# Altium project pca63100.PrjPCB (part 1 of 3)
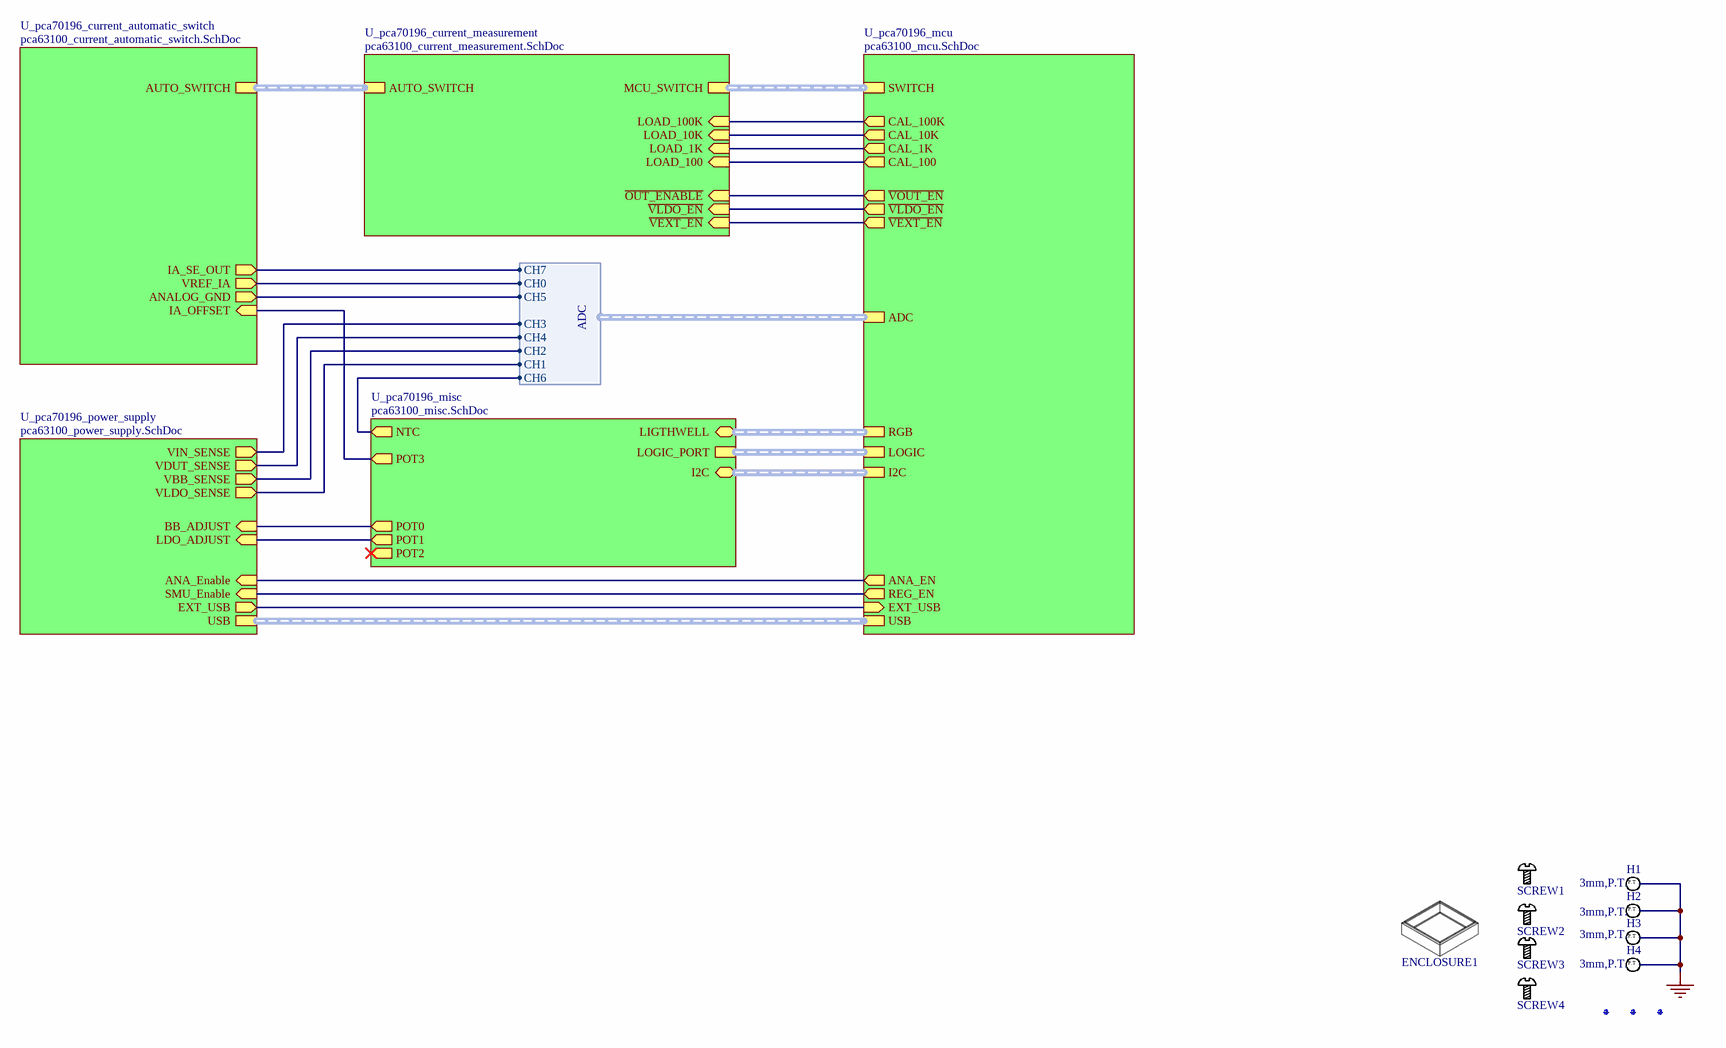
[diagram p0: pca63100_top.SchDoc]
Author: HANY; BoardThickness: 1.6mm; BoardTitle: Power Profiler Kit II; NrOfLayers: 4; Organization: Nordic Semiconductor; PCAName: pca63100; PCBNumber: 400491; PCBRevision: 0016HANY; PCBStackup: 4001; ProjectName: Power Profiler Kit II; ProjectNumber: PCA63100; Revision: 1.0.1; SilkscreenColor: White; SoldermaskColor: Blue; SurfaceFinish: ENIG
6 sheets, 280 parts. Net scope: hierarchical (ports join the sheet entries above them; power ports are global).
Board file: 400491.PcbDoc
Sheets:
  pca63100_top.SchDoc
    U_pca70196_current_automatic_switch = pca63100_current_automatic_switch.SchDoc
    U_pca70196_current_measurement = pca63100_current_measurement.SchDoc
    U_pca70196_power_supply = pca63100_power_supply.SchDoc
    U_pca70196_misc = pca63100_misc.SchDoc
    U_pca70196_mcu = pca63100_mcu.SchDoc

## Sheet pca63100_top.SchDoc: Power Profiler Kit II
size A3; Organization: Nordic Semiconductor; Revision: 1.0.1; SheetNumber: 1; SheetTotal: 6; Author: HANY; CompanyName: Nordic Semiconductor; DrawnBy: HANY; DocumentSize: A3; ProjectName: Power Profiler Kit II

### Parts
ENCLOSURE1  Plastic Enclosure  [Enclosure_PPK2]  (value not drawn)
Fid1  Fiducial mark  [Fiducial_Round-Square]  (value not drawn)  (no BOM)
Fid2  Fiducial mark  [Fiducial_Round-Square]  (value not drawn)  (no BOM)
Fid3  Fiducial mark  [Fiducial_Round-Square]  (value not drawn)  (no BOM)
H1  3mm,P.T.  [HOLE_PT_3MM]  (no BOM)
H2  3mm,P.T.  [HOLE_PT_3MM]  (no BOM)
H3  3mm,P.T.  [HOLE_PT_3MM]  (no BOM)
H4  3mm,P.T.  [HOLE_PT_3MM]  (no BOM)
SCREW1  Screw  [Screw_25x50_pan_tx]  (value not drawn)
SCREW2  Screw  [Screw_25x50_pan_tx]  (value not drawn)
SCREW3  Screw  [Screw_25x50_pan_tx]  (value not drawn)
SCREW4  Screw  [Screw_25x50_pan_tx]  (value not drawn)

### Sub-sheets
U_pca70196_current_automatic_switch = pca63100_current_automatic_switch.SchDoc: IA_SE_OUT (out), IA_OFFSET (in), AUTO_SWITCH (harness SW), VREF_IA (out), ANALOG_GND (out)
U_pca70196_current_measurement = pca63100_current_measurement.SchDoc: ~{OUT_ENABLE} (in), LOAD_100 (in), LOAD_1K (in), LOAD_100K (in), LOAD_10K (in), ~{VEXT_EN} (in), MCU_SWITCH (harness SW), AUTO_SWITCH (harness SW), ~{VLDO_EN} (in)
U_pca70196_mcu = pca63100_mcu.SchDoc: RGB (harness LED), SWITCH (harness SW), I2C (harness I2C), ADC (harness ADC), CAL_10K (out), USB (harness USB), CAL_100K (out), CAL_1K (out), ~{VEXT_EN} (out), CAL_100 (out), ~{VLDO_EN} (out), ~{VOUT_EN} (out), EXT_USB (in), REG_EN (out), ANA_EN (out), LOGIC (harness LP)
U_pca70196_misc = pca63100_misc.SchDoc: POT0 (out), POT1 (out), POT2 (out), POT3 (out), LIGTHWELL (bidir, harness LED), I2C (bidir, harness I2C), NTC (out), LOGIC_PORT (harness LP)
U_pca70196_power_supply = pca63100_power_supply.SchDoc: USB (harness USB), BB_ADJUST (in), LDO_ADJUST (in), VDUT_SENSE (out), VIN_SENSE (out), VLDO_SENSE (out), VBB_SENSE (out), EXT_USB (out), ANA_Enable (in), SMU_Enable (in)

### Harnesses
ADC: CH0, CH1, CH2, CH3, CH4, CH5, CH6, CH7

### Nets
GND: H1.1 H2.1 H3.1 H4.1
P0.02/AIN0_VREF_IA: sheet U_pca70196_current_automatic_switch/VREF_IA, sheet U_pca70196_mcu/ADC.CH0
P0.03/AIN1_VLDO: sheet U_pca70196_power_supply/VLDO_SENSE, sheet U_pca70196_mcu/ADC.CH1
P0.04/AIN2_VBB: sheet U_pca70196_power_supply/VBB_SENSE, sheet U_pca70196_mcu/ADC.CH2
P0.05/AIN3_VIN: sheet U_pca70196_power_supply/VIN_SENSE, sheet U_pca70196_mcu/ADC.CH3
P0.06_VEXT_EN: sheet U_pca70196_current_measurement/~{VEXT_EN}, sheet U_pca70196_mcu/~{VEXT_EN}
P0.07_VLDO_EN: sheet U_pca70196_current_measurement/~{VLDO_EN}, sheet U_pca70196_mcu/~{VLDO_EN}
P0.08_ANA_EN: sheet U_pca70196_power_supply/ANA_Enable, sheet U_pca70196_mcu/ANA_EN
P0.20_CAL100K: sheet U_pca70196_current_measurement/LOAD_100K, sheet U_pca70196_mcu/CAL_100K
P0.21_CAL10K: sheet U_pca70196_current_measurement/LOAD_10K, sheet U_pca70196_mcu/CAL_10K
P0.22_CAL1K: sheet U_pca70196_current_measurement/LOAD_1K, sheet U_pca70196_mcu/CAL_1K
P0.23_CAL100: sheet U_pca70196_current_measurement/LOAD_100, sheet U_pca70196_mcu/CAL_100
P0.28/AIN4_VDUT: sheet U_pca70196_power_supply/VDUT_SENSE, sheet U_pca70196_mcu/ADC.CH4
P0.29/AIN5_AGND: sheet U_pca70196_current_automatic_switch/ANALOG_GND, sheet U_pca70196_mcu/ADC.CH5
P0.30/AIN6_NTC: sheet U_pca70196_misc/NTC, sheet U_pca70196_mcu/ADC.CH6
P0.31/AIN7_VSE_IA: sheet U_pca70196_current_automatic_switch/IA_SE_OUT, sheet U_pca70196_mcu/ADC.CH7
P1.04_VOUT_EN: sheet U_pca70196_current_measurement/~{OUT_ENABLE}, sheet U_pca70196_mcu/~{VOUT_EN}
P1.09_EXT_USB: sheet U_pca70196_power_supply/EXT_USB, sheet U_pca70196_mcu/EXT_USB
P1.13: sheet U_pca70196_power_supply/SMU_Enable, sheet U_pca70196_mcu/REG_EN
POT0: sheet U_pca70196_power_supply/BB_ADJUST, sheet U_pca70196_misc/POT0
POT1: sheet U_pca70196_power_supply/LDO_ADJUST, sheet U_pca70196_misc/POT1
POT3: sheet U_pca70196_current_automatic_switch/IA_OFFSET, sheet U_pca70196_misc/POT3

### Buses and harness runs
harness sheet U_pca70196_current_automatic_switch/AUTO_SWITCH = sheet U_pca70196_current_measurement/AUTO_SWITCH
harness sheet U_pca70196_current_measurement/MCU_SWITCH = sheet U_pca70196_mcu/SWITCH
harness sheet U_pca70196_mcu/I2C = sheet U_pca70196_misc/I2C
harness sheet U_pca70196_mcu/LOGIC = sheet U_pca70196_misc/LOGIC_PORT
harness sheet U_pca70196_mcu/RGB = sheet U_pca70196_misc/LIGTHWELL
harness sheet U_pca70196_mcu/USB = sheet U_pca70196_power_supply/USB

### Notes on the sheet
- Size
- Date:
- A3
- Project Number
- Sheet         of
- Revision
- File:
- Drawn By:
- (in symbol Hole_3MM_PT) P.T

### Library data of the parts
ENCLOSURE1 = Enclosure_PPK2: PPK2 Moulded plastic casing; Manufacturer: Proto Labs, Inc.; Manufacturer Part Number: PPK plexi rev 1.2; Part number IPS: 4971; Pad Count: 0; Part Number: Enclosure_PPK2; ComponentLink1Description: Datasheet; ComponentLink2Description: Supplier link; HelpURL: https://www.protolabs.com; Footprint Doc: Plastic casing; LatestRevisionDate: 2020-10-01; Publisher: Nordic Semiconductor; Published: 2020-10-01; Value: Plastic Enclosure; Component Class: Mechanical; PartId: 101200001
Fid1-Fid3 = Fid-Mark-Round-Square: Artikkelnr Noca: N.A.; Pad Count: 1; Part Number: Fid-Mark-Round-Square; LatestRevisionDate: 2017-01-30; Pin Count: 1; Publisher: Nordic Semiconductor; Published: 2009-12-12; Footprint Doc: Fiducial; Part number IPS: N.A.; ComponentLink1Description: Datasheet; ComponentLink2Description: Supplier link; Component Class: Connectors; PartId: 100500075
H1-H4 = Hole_3MM_PT: Regular Plate Through, 3mm hole; Manufacturer: Nordic Semiconductor; Artikkelnr Noca: N.A.; Pad Count: 1; Part Number: Hole_3MM_PT; Footprint Doc: Hole_3MM_PT; LatestRevisionDate: 2013-05-29; Pin Count: 1; Publisher: Nordic Semiconductor; Published: 2013-05-29; Value: 3mm,P.T.; Note: Regular Plate Through, 3mm hole; Part number IPS: N.A.; ComponentLink1Description: Datasheet; ComponentLink2Description: Supplier link; Component Class: Connectors; PartId: 100500146
SCREW1-SCREW4 = Screw_25x50_pan_tx: Pan head, torx, 2.5x5mm screw; Manufacturer: Bossard; Manufacturer Part Number: 3205129; Part number IPS: 4972; Pad Count: 0; Part Number: Screw_25x50_pan_tx; ComponentLink1Description: Datasheet; ComponentLink2Description: Supplier link; HelpURL: https://www.tme.eu/pl/en/details/b2.5x5_bn13265/screws/bossard/3205129/; Footprint Doc: T8 screw; LatestRevisionDate: 2020-10-01; Publisher: Nordic Semiconductor; Published: 2020-10-01; Value: Screw; Component Class: Mechanical; PartId: 101200002

## Sheet pca63100_current_automatic_switch.SchDoc: Power Profiler Kit II
size A3; Organization: Nordic Semiconductor; Revision: 1.0.1; SheetNumber: 5; SheetTotal: 6; Author: HANY; CompanyName: Nordic Semiconductor; DrawnBy: HANY; DocumentSize: A3; ProjectName: Power Profiler Kit II
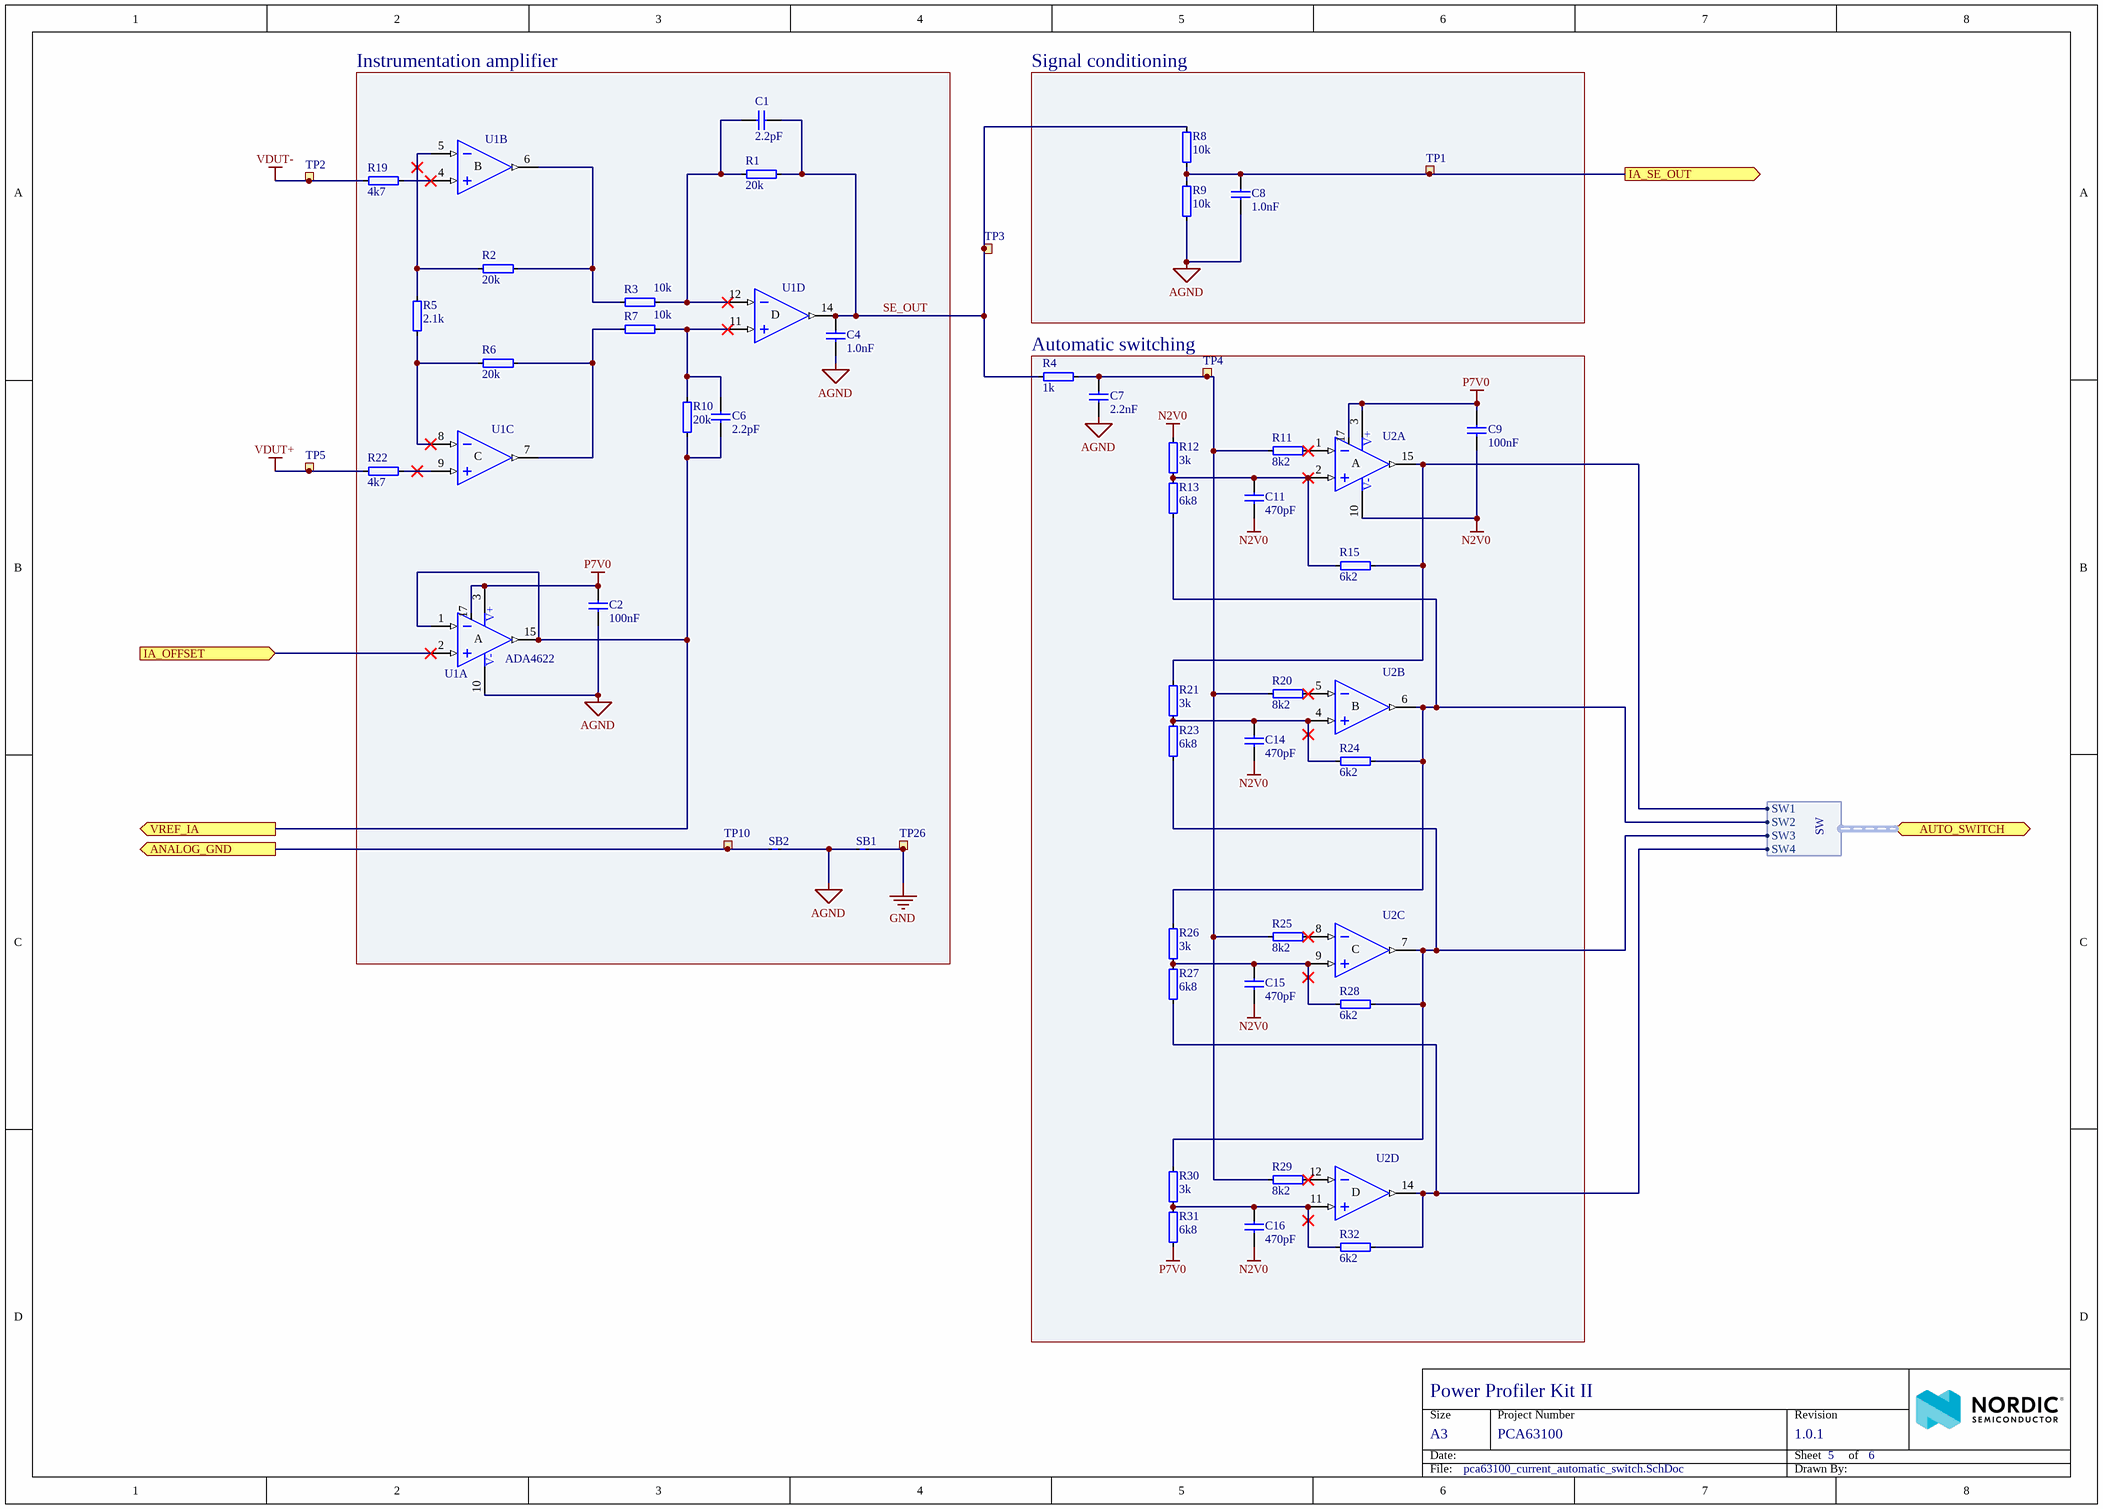
[diagram p1: pca63100_current_automatic_switch.SchDoc]

### Parts
C1  2.2pF  [CAPC0603X03L_C]
C2  100nF  [CAPC0603X03L_C]
C4  1.0nF  [CAPC0603X03L_C]
C6  2.2pF  [CAPC0603X03L_C]
C7  2.2nF  [CAPC0603X03L_C]
C8  1.0nF  [CAPC0603X03L_C]
C9  100nF  [CAPC0603X03L_C]
C11  470pF  [CAPC0603X03L_C]
C14  470pF  [CAPC0603X03L_C]
C15  470pF  [CAPC0603X03L_C]
C16  470pF  [CAPC0603X03L_C]
R1  20k  [RESC0603X03L_C]
R2  20k  [RESC0603X03L_C]
R3  10k  [RESC0603X03L_C]
R4  1k  [RESC0603X03L_C]
R5  2.1k  [RESC0603X03L_C]
R6  20k  [RESC0603X03L_C]
R7  10k  [RESC0603X03L_C]
R8  10k  [RESC0603X03L_C]
R9  10k  [RESC0603X03L_C]
R10  20k  [RESC0603X03L_C]
R11  8k2  [RESC0603X03L_C]
R12  3k  [RESC0603X03L_C]
R13  6k8  [RESC0603X03L_C]
R15  6k2  [RESC0603X03L_C]
R19  4k7  [RESC0603X03L_C]
R20  8k2  [RESC0603X03L_C]
R21  3k  [RESC0603X03L_C]
R22  4k7  [RESC0603X03L_C]
R23  6k8  [RESC0603X03L_C]
R24  6k2  [RESC0603X03L_C]
R25  8k2  [RESC0603X03L_C]
R26  3k  [RESC0603X03L_C]
R27  6k8  [RESC0603X03L_C]
R28  6k2  [RESC0603X03L_C]
R29  8k2  [RESC0603X03L_C]
R30  3k  [RESC0603X03L_C]
R31  6k8  [RESC0603X03L_C]
R32  6k2  [RESC0603X03L_C]
SB1  NetTie_200um  [NetTie_200um]  (value not drawn)  (net tie, no BOM)
SB2  NetTie_200um  [NetTie_200um]  (value not drawn)  (net tie, no BOM)
TP1  Ø0.7mm,SMD  [TP_SMD_Ø0.7mm]  (value not drawn)  (no BOM)
TP2  Ø0.7mm,SMD  [TP_SMD_Ø0.7mm]  (value not drawn)  (no BOM)
TP3  Ø0.7mm,SMD  [TP_SMD_Ø0.7mm]  (value not drawn)  (no BOM)
TP4  Ø0.7mm,SMD  [TP_SMD_Ø0.7mm]  (value not drawn)  (no BOM)
TP5  Ø0.7mm,SMD  [TP_SMD_Ø0.7mm]  (value not drawn)  (no BOM)
TP10  Ø0.7mm,SMD  [TP_SMD_Ø0.7mm]  (value not drawn)  (no BOM)
TP26  Ø0.7mm,SMD  [TP_SMD_Ø0.7mm]  (value not drawn)  (no BOM)
U1  ADA4622  [QFN65P400X400X80_HS-17N]  (parts A,B,C,D of 4)
U2  ADA4622  [QFN65P400X400X80_HS-17N]  (value not drawn)  (parts A,B,C,D of 4)

### Blocks framed on the sheet
Instrumentation amplifier: C1 C2 C4 C6 R1-R3 R5-R7 R10 R19 R22 SB1 SB2 TP10 TP26 U1
Signal conditioning: C8 R8 R9 TP1
Automatic switching: C7 C9 C11 C14-C16 R4 R11-R13 R15 R20 R21 R23-R32 TP4 U2

### Ports
ANALOG_GND (out), AUTO_SWITCH (bidir, harness SW), IA_OFFSET (in), IA_SE_OUT (out), VREF_IA (out)

### Harnesses
SW: SW1, SW2, SW3, SW4

### Nets
AGND: C2.2 C4.1 C7.1 C8.1 R9.1 SB1.1 SB2.2 U1.10(VSS)
GND: SB1.2 TP26.1
N2V0: C9.1 C11.1 C14.1 C15.1 C16.1 R12.2 U2.10(VSS)
P7V0: C2.1 C9.2 R31.1 U1.3(VDD) U1.17(EPAD) U2.3(VDD) U2.17(EPAD)
VDUT+: R22.2 TP5.1
VDUT-: R19.2 TP2.1
AUTO_SW1: R15.2 R21.2 U2.15(OUTA) ; port AUTO_SWITCH.SW1
AUTO_SW2: R13.1 R24.2 R26.2 U2.6(OUTB) ; port AUTO_SWITCH.SW2
AUTO_SW3: R23.1 R28.2 R30.2 U2.7(OUTC) ; port AUTO_SWITCH.SW3
AUTO_SW4: R27.1 R32.2 U2.14(OUTD) ; port AUTO_SWITCH.SW4
P0.02/AIN0_VREF_IA: C6.1 R10.1 U1.1(IN_A-) U1.15(OUTA) ; port VREF_IA
P0.29/AIN5_AGND: SB2.1 TP10.1 ; port ANALOG_GND
P0.31/AIN7_VSE_IA: C8.2 R8.2 R9.2 TP1.1 ; port IA_SE_OUT
POT3: U1.2(IN_A+) ; port IA_OFFSET
SE_OUT: C1.2 C4.2 R1.2 R4.1 R8.1 TP3.1 U1.14(OUTD)
NetC1_1: C1.1 R1.1 R3.2 U1.12(IN_D-)
NetC6_2: C6.2 R7.2 R10.2 U1.11(IN_D+)
NetC7_2: C7.2 R4.2 R11.1 R20.1 R25.1 R29.1 TP4.1
NetC11_2: C11.2 R12.1 R13.2 R15.1 U2.2(IN_A+)
NetC14_2: C14.2 R21.1 R23.2 R24.1 U2.4(IN_B+)
NetC15_2: C15.2 R26.1 R27.2 R28.1 U2.9(IN_C+)
NetC16_2: C16.2 R30.1 R31.2 R32.1 U2.11(IN_D+)
NetR2_1: R2.1 R5.2 U1.5(IN_B-)
NetR2_2: R2.2 R3.1 U1.6(OUTB)
NetR5_1: R5.1 R6.1 U1.8(IN_C-)
NetR6_2: R6.2 R7.1 U1.7(OUTC)
NetR11_2: R11.2 U2.1(IN_A-)
NetR19_1: R19.1 U1.4(IN_B+)
NetR20_2: R20.2 U2.5(IN_B-)
NetR22_1: R22.1 U1.9(IN_C+)
NetR25_2: R25.2 U2.8(IN_C-)
NetR29_2: R29.2 U2.12(IN_D-)

Not connected (* = marked no-connect by the designer): U1 13(NIC) 16(NIC); U2 13(NIC) 16(NIC)

### Notes on the sheet
- Size
- Date:
- A3
- Project Number
- Sheet         of
- Revision
- File:
- Drawn By:
- (in symbol ADA4622-4, part A) V+; A; V-
- (in symbol ADA4622-4, part B) B
- (in symbol ADA4622-4, part C) C
- (in symbol ADA4622-4, part D) D

### Library data of the parts
C1 C6 = C0201-2.2p: Chip Cap 0201; Note: Chip Cap 1%; Artikkelnr Noca: N.A.; Pad Count: 2; Part Number: C0201-2.2p; ComponentLink1Description: Datasheet; ComponentLink2Description: Supplier link; Footprint Doc: 0201; LatestRevisionDate: 2014-11-13; Pin Count: 2; Publisher: Nordic Semiconductor; Published: 2014-11-13; Value: 2.2pF; Part number IPS: N.A.; Component Class: Capacitors; PartId: 100200020
C2 C9 = C0201-100n: Capacitor, X5R, ±10%; Part number IPS: 00000001248, 00000002505; Note: 16V; Artikkelnr Noca: N.A.; Pad Count: 2; Part Number: C0201-100n; Footprint Doc: 0201; LatestRevisionDate: 2017-11-09; Pin Count: 2; Publisher: Nordic Semiconductor; Published: 2014-11-13; Value: 100nF; ComponentLink1Description: Datasheet; ComponentLink2Description: Supplier link; Component Class: Capacitors; PartId: 100200078
C4 C8 = C0201-1n0: Capacitor, X7R, ±10%; Part number IPS: 00000003206; Note: 16V; Artikkelnr Noca: N.A.; Pad Count: 2; Part Number: C0201-1n0; ComponentLink1Description: Datasheet; ComponentLink2Description: Supplier link; Footprint Doc: 0201; LatestRevisionDate: 2020-10-13; Pin Count: 2; Publisher: Nordic Semiconductor; Published: 2014-11-13; Value: 1.0nF; Component Class: Capacitors; PartId: 100200056
C7 = C0201-2n2: Capacitor, X7R, ±10%, 10V; Part number IPS: 00000001778; Artikkelnr Noca: N.A.; Pad Count: 2; Part Number: C0201-2n2; ComponentLink1Description: Datasheet; ComponentLink2Description: Supplier link; Footprint Doc: 0201; LatestRevisionDate: 2014-11-13; Pin Count: 2; Publisher: Nordic Semiconductor; Published: 2014-11-13; Value: 2.2nF; Note: 10V; Component Class: Capacitors; PartId: 100200060
C11 C14-C16 = C0201-470p: Chip Cap 0201; Part number IPS: 00000005775; Note: Chip Cap 1%; Artikkelnr Noca: N.A.; Pad Count: 2; Part Number: C0201-470p; ComponentLink1Description: Datasheet; ComponentLink2Description: Supplier link; Footprint Doc: 0201; LatestRevisionDate: 2020-10-13; Publisher: Nordic Semiconductor; Published: 2014-11-13; Value: 470pF; Component Class: Capacitors; PartId: 100200052
  C11 C14: Pin Count: 2
R1 R2 R6 R10 = R0201-20k_0.1%: Resistor, ±0.1%, 0.031W; Part number IPS: 00000004785; Note: Chip Res 0.1%; Artikkelnr Noca: N.A.; Pad Count: 2; Part Number: R0201-20k_0.1%; ComponentLink1Description: Datasheet; ComponentLink2Description: Supplier link; Footprint Doc: 0201; LatestRevisionDate: 2019-10-07; Pin Count: 2; Publisher: Nordic Semiconductor; Published: 2019-10-07; Value: 20k; Component Class: Resistors; PartId: 100100598
R3 R7-R9 = R0201-10k_0.1%: Resistor, ±0.1%, 0.031W; Part number IPS: 00000004786; Note: Chip Res 0.1%; Artikkelnr Noca: N.A.; Pad Count: 2; Part Number: R0201-10k_0.1%; ComponentLink1Description: Datasheet; ComponentLink2Description: Supplier link; Footprint Doc: 0201; LatestRevisionDate: 2019-10-07; Pin Count: 2; Publisher: Nordic Semiconductor; Published: 2019-10-07; Value: 10k; Component Class: Resistors; PartId: 100100597
R4 = R0201-1k0: Resistor, ±1%, 0.05W; Part number IPS: 00000005786; Note: Chip Res 1%; Artikkelnr Noca: N.A.; Pad Count: 2; Part Number: R0201-1k0; ComponentLink1Description: Datasheet; ComponentLink2Description: Supplier link; Footprint Doc: 0201; LatestRevisionDate: 2014-11-13; Publisher: Nordic Semiconductor; Published: 2014-11-13; Value: 1k; Component Class: Resistors; PartId: 100100043
R5 = R0201-2k1: RES SMD 2.1K OHM 1% 1/20W 0201; Manufacturer: Panasonic; Manufacturer Part Number: ERJ-1GEF2101C; Part number IPS: 00000004787; Note: Chip Res 1%; Artikkelnr Noca: N.A.; Pad Count: 2; Part Number: R0201-2k1; ComponentLink1Description: Datasheet; ComponentLink2Description: Supplier link; HelpURL: http://media.digikey.com/pdf/Data%20Sheets/Panasonic%20Resistors%20Thermistors%20PDFs/ERJ_G,R,E_Rev08.pdf; Footprint Doc: 0201; LatestRevisionDate: 2017-02-13; Pin Count: 2; Publisher: Nordic Semiconductor; Published: 2017-02-13; Value: 2.1k; Supplier 1: Digi-Key; Supplier Part Number 1: P2.10KABCT-ND; Component Class: Resistors; PartId: 100100573
R11 R15 R20 R24 R25 R28 R29 = R0201-8k2: Resistor, ±1%, 0.05W; Part number IPS: 00000004788; Note: Chip Res 1%; Artikkelnr Noca: N.A.; Pad Count: 2; Part Number: R0201-8k2; ComponentLink1Description: Datasheet; ComponentLink2Description: Supplier link; Footprint Doc: 0201; LatestRevisionDate: 2014-11-13; Pin Count: 2; Publisher: Nordic Semiconductor; Published: 2014-11-13; Component Class: Resistors; PartId: 100100064
  R11 R20 R25 R29: Value: 8k2
  R15 R24 R28: Value: 6k2
R12 R21 R26 R30 = R0201-3k0: Resistor, ±1%, 0.05W; Part number IPS: 00000001688; Note: Chip Res 1%; Artikkelnr Noca: N.A.; Pad Count: 2; Part Number: R0201-3k0; ComponentLink1Description: Datasheet; ComponentLink2Description: Supplier link; Footprint Doc: 0201; LatestRevisionDate: 2014-11-13; Pin Count: 2; Publisher: Nordic Semiconductor; Published: 2014-11-13; Value: 3k; Component Class: Resistors; PartId: 100100056
R13 R23 R27 R31 R32 = R0201-6k8: Resistor, ±1%, 0.05W; Part number IPS: 00000001705; Note: Chip Res 1%; Artikkelnr Noca: N.A.; Pad Count: 2; Part Number: R0201-6k8; ComponentLink1Description: Datasheet; ComponentLink2Description: Supplier link; Footprint Doc: 0201; LatestRevisionDate: 2014-11-13; Pin Count: 2; Publisher: Nordic Semiconductor; Published: 2014-11-13; Component Class: Resistors; PartId: 100100063
  R13 R23 R27 R31: Value: 6k8
  R32: Value: 6k2
R19 R22 = R0201-4k7: Resistor, ±1%, 0.05W; Part number IPS: 00000001706; Note: Chip Res 1%; Artikkelnr Noca: N.A.; Pad Count: 2; Part Number: R0201-4k7; ComponentLink1Description: Datasheet; ComponentLink2Description: Supplier link; Footprint Doc: 0201; LatestRevisionDate: 2014-11-13; Pin Count: 2; Publisher: Nordic Semiconductor; Published: 2014-11-13; Value: 4k7; Component Class: Resistors; PartId: 100100061
SB1 SB2 = NetTie 0.2mm: Net Tie; Artikkelnr Noca: N.A.; Pad Count: 2; Part Number: NetTie 0.2mm; ComponentLink1Description: Datasheet; ComponentLink2Description: Supplier link; Footprint Doc: NetTie; LatestRevisionDate: 2019-10-07; Pin Count: 2; Publisher: Nordic Semiconductor; Published: 2019-10-07; Value: NetTie_200um; Part number IPS: N.A.; Component Class: Connectors; PartId: 100500654
TP1-TP5 TP10 TP26 = TP_SMD_Ø0.7MM: 0.7mm circular SMD testpad; Manufacturer: Nordic Semiconductor; Artikkelnr Noca: N.A.; Pad Count: 1; Part Number: TP_SMD_Ø0.7MM; ComponentLink1Description: Datasheet; ComponentLink2Description: Supplier link; Footprint Doc: TP_SMD_Ø0.7mm; LatestRevisionDate: 2017-12-14; Pin Count: 1; Publisher: Nordic Semiconductor; Published: 2017-12-14; Value: Ø0.7mm,SMD; Part number IPS: N.A.; Component Class: Connectors; PartId: 100500474
U1 U2 = ADA4622-4: J-FET Amplifier 4 Circuit Rail-to-Rail 16-LFCSP (4x4); Manufacturer: Analog Devices; Manufacturer Part Number: ADA4622-4ACPZ-RL; Part number IPS: 00000004963; Artikkelnr Noca: N.A.; Pad Count: 17; Part Number: ADA4622-4; ComponentLink1URL: https://www.analog.com/media/en/technical-documentation/data-sheets/ada4622-1-4622-2-4622-4.pdf; ComponentLink1Description: Datasheet; ComponentLink2URL: https://www.digikey.no/product-detail/en/analog-devices-inc/ADA4622-4ACPZ-RL/ADA4622-4ACPZ-RL-ND/6490586; ComponentLink2Description: Supplier link; HelpURL: https://www.analog.com/en/products/ada4622-4.html; Footprint Doc: QFN-16; LatestRevisionDate: 2019-06-19; Pin Count: 17; Publisher: Nordic Semiconductor; Published: 2019-06-19; Value: ADA4622; Supplier 1: Digi-Key; Supplier Part Number 1: ADA4622-4ACPZ-R7-ND; Supplier 2: Mouser; Supplier Part Number 2: 584-ADA4622-4ACPZ-R7; Component Class: Misc_ICs; PartId: 101900585

## Sheet pca63100_current_measurement.SchDoc: Power Profiler Kit II
size A3; Organization: Nordic Semiconductor; Revision: 1.0.1; SheetNumber: 4; SheetTotal: 6; Author: HANY; CompanyName: Nordic Semiconductor; DrawnBy: HANY; DocumentSize: A3; ProjectName: Power Profiler Kit II
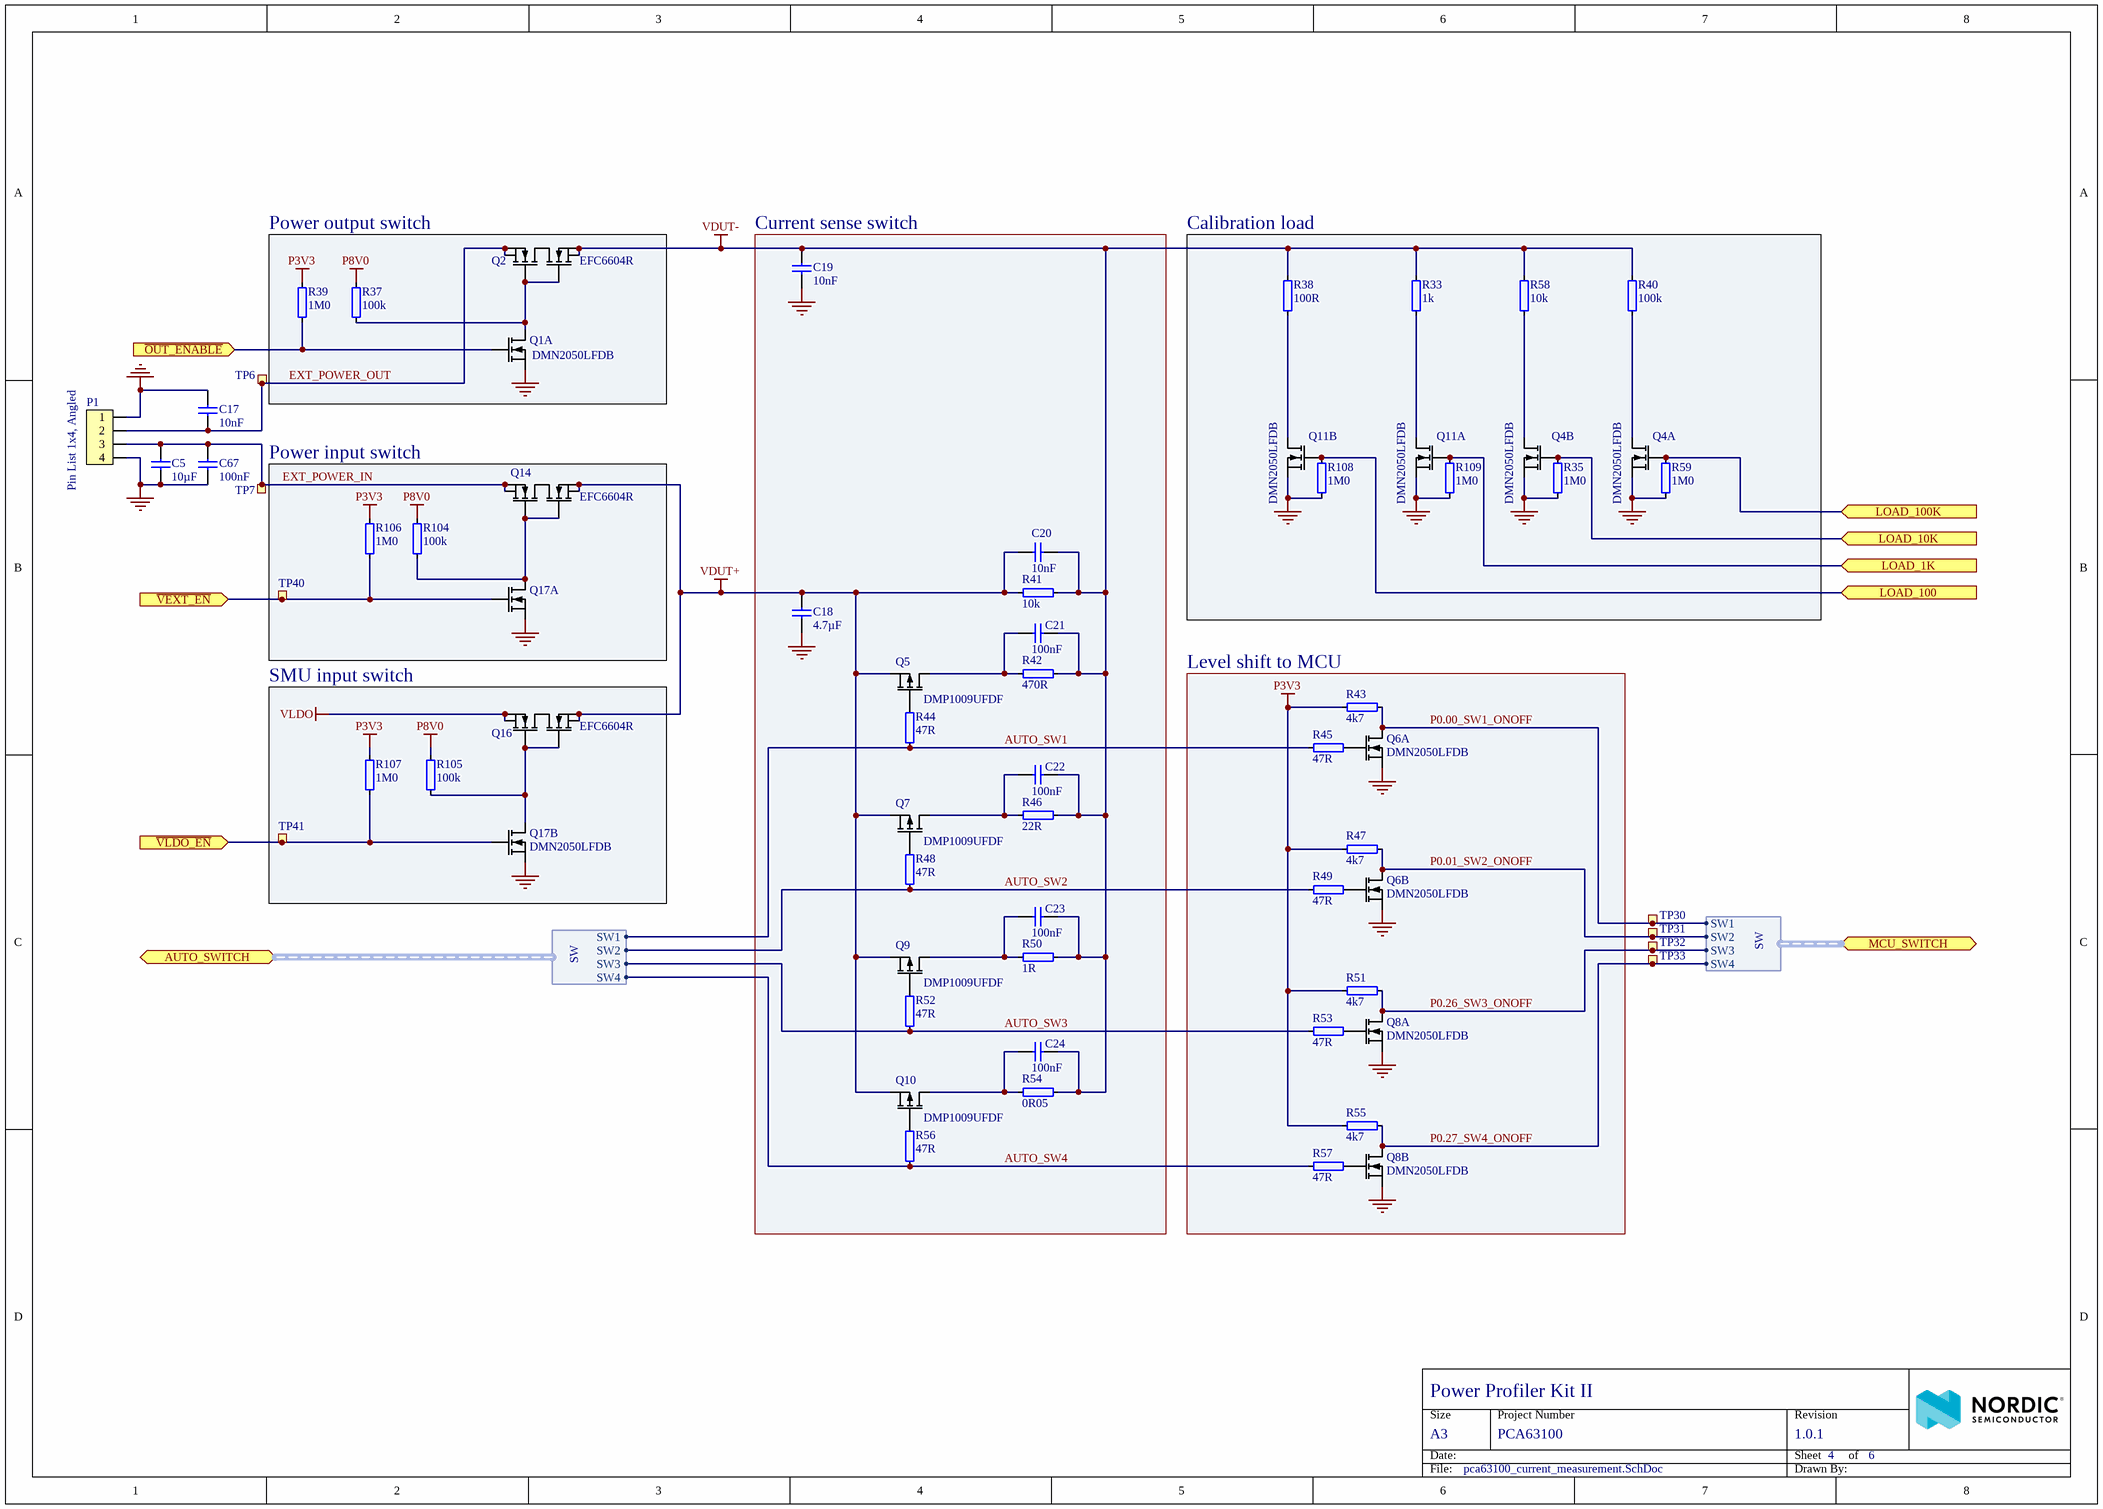
[diagram p2: pca63100_current_measurement.SchDoc]

### Parts
C5  10µF  [CAPC1608X06L]
C17  10nF  [CAPC0603X03L_C]
C18  4.7µF  [CAPC1005X04L]
C19  10nF  [CAPC0603X03L_C]
C20  10nF  [CAPC0603X03L_C]
C21  100nF  [CAPC0603X03L_C]
C22  100nF  [CAPC0603X03L_C]
C23  100nF  [CAPC0603X03L_C]
C24  100nF  [CAPC0603X03L_C]
C67  100nF  [CAPC0603X03L_C]
P1  Pin List 1x4, Angled  [LIST_ANG_1x4-SMD-2.54MM]
Q1  DMN2050LFDB  [DFN65P200X60_HS-6N]  (part A of 2)
Q2  EFC6604R  [BGA6C65P2X3_146X191X22]
Q4  DMN2050LFDB  [DFN65P200X60_HS-6N]  (parts A,B of 2)
Q5  DMP1009UFDF  [UDFN65P200X200X60_HS-6N]
Q6  DMN2050LFDB  [DFN65P200X60_HS-6N]  (parts A,B of 2)
Q7  DMP1009UFDF  [UDFN65P200X200X60_HS-6N]
Q8  DMN2050LFDB  [DFN65P200X60_HS-6N]  (parts A,B of 2)
Q9  DMP1009UFDF  [UDFN65P200X200X60_HS-6N]
Q10  DMP1009UFDF  [UDFN65P200X200X60_HS-6N]
Q11  DMN2050LFDB  [DFN65P200X60_HS-6N]  (parts A,B of 2)
Q14  EFC6604R  [BGA6C65P2X3_146X191X22]
Q16  EFC6604R  [BGA6C65P2X3_146X191X22]
Q17  DMN2050LFDB  [DFN65P200X60_HS-6N]  (value not drawn)  (parts A,B of 2)
R33  1k  [RESC1005X04L]
R35  1M0  [RESC0603X03L_C]
R37  100k  [RESC0603X03L_C]
R38  100R  [RESC2012X11L]
R39  1M0  [RESC0603X03L_C]
R40  100k  [RESC1005X04L]
R41  10k  [RESC1005X04L]
R42  470R  [RESC1005X04L]
R43  4k7  [RESC0603X03L_C]
R44  47R  [RESC0603X03L_C]
R45  47R  [RESC0603X03L_C]
R46  22R  [RESC1005X04L]
R47  4k7  [RESC0603X03L_C]
R48  47R  [RESC0603X03L_C]
R49  47R  [RESC0603X03L_C]
R50  1R  [RESC1005X04L]
R51  4k7  [RESC0603X03L_C]
R52  47R  [RESC0603X03L_C]
R53  47R  [RESC0603X03L_C]
R54  0R05  [RESC1005X04L]
R55  4k7  [RESC0603X03L_C]
R56  47R  [RESC0603X03L_C]
R57  47R  [RESC0603X03L_C]
R58  10k  [RESC0603X03L_C]
R59  1M0  [RESC0603X03L_C]
R104  100k  [RESC0603X03L_C]
R105  100k  [RESC0603X03L_C]
R106  1M0  [RESC0603X03L_C]
R107  1M0  [RESC0603X03L_C]
R108  1M0  [RESC0603X03L_C]
R109  1M0  [RESC0603X03L_C]
TP6  Ø1.5mm,SMD  [TP_SMD_Ø1.5mm]  (value not drawn)  (no BOM)
TP7  Ø1.5mm,SMD  [TP_SMD_Ø1.5mm]  (value not drawn)  (no BOM)
TP30  Ø0.7mm,SMD  [TP_SMD_Ø0.7mm]  (value not drawn)  (no BOM)
TP31  Ø0.7mm,SMD  [TP_SMD_Ø0.7mm]  (value not drawn)  (no BOM)
TP32  Ø0.7mm,SMD  [TP_SMD_Ø0.7mm]  (value not drawn)  (no BOM)
TP33  Ø0.7mm,SMD  [TP_SMD_Ø0.7mm]  (value not drawn)  (no BOM)
TP40  Ø0.7mm,SMD  [TP_SMD_Ø0.7mm]  (value not drawn)  (no BOM)
TP41  Ø0.7mm,SMD  [TP_SMD_Ø0.7mm]  (value not drawn)  (no BOM)

### Blocks framed on the sheet
Power output switch: Q1 Q2 R37 R39
Current sense switch: C18-C24 Q5 Q7 Q9 Q10 R41 R42 R44 R46 R48 R50 R52 R54 R56
Calibration load: Q4 Q11 R33 R35 R38 R40 R58 R59 R108 R109
Power input switch: Q14 Q17 R104 R106 TP40
SMU input switch: Q16 Q17 R105 R107 TP41
Level shift to MCU: Q6 Q8 R43 R45 R47 R49 R51 R53 R55 R57

### Ports
AUTO_SWITCH (bidir, harness SW), LOAD_1K (in), LOAD_10K (in), LOAD_100 (in), LOAD_100K (in), MCU_SWITCH (bidir, harness SW), ~{OUT_ENABLE} (in), ~{VEXT_EN} (in), ~{VLDO_EN} (in)

### Harnesses
SW: SW1, SW2, SW3, SW4

### Nets
GND: C5.2 C17.1 C18.2 C19.1 C67.2 P1.1 P1.4 Q1.1(S1) Q4.1(S1) Q4.4(S2) Q6.1(S1) Q6.4(S2) Q8.1(S1) Q8.4(S2) Q11.1(S1) Q11.4(S2) Q17.1(S1) Q17.4(S2) R35.1 R59.1 R108.1 R109.1
P3V3: R39.2 R43.2 R47.2 R51.2 R55.2 R106.2 R107.2
P8V0: R37.1 R104.2 R105.2
VDUT+: C18.1 C20.1 Q5.2(S) Q7.2(S) Q9.2(S) Q10.2(S) Q14.1(S1) Q14.3(S2) Q16.1(S1) Q16.3(S2) R41.1
VDUT-: C19.2 C20.2 C21.2 C22.2 C23.2 C24.2 Q2.1(S1) Q2.3(S2) R33.1 R38.2 R40.2 R41.2 R42.2 R46.2 R50.2 R54.1 R58.1
VLDO: Q16.4(S2) Q16.6(S2)
AUTO_SW1: R44.1 R45.2 ; port AUTO_SWITCH.SW1
AUTO_SW2: R48.1 R49.2 ; port AUTO_SWITCH.SW2
AUTO_SW3: R52.1 R53.2 ; port AUTO_SWITCH.SW3
AUTO_SW4: R56.1 R57.2 ; port AUTO_SWITCH.SW4
EXT_POWER_IN: C5.1 C67.1 P1.3 Q14.4(S2) Q14.6(S2) TP7.1
EXT_POWER_OUT: C17.2 P1.2 Q2.4(S2) Q2.6(S2) TP6.1
P0.00_SW1_ONOFF: Q6.6(D1) R43.1 TP30.1 ; port MCU_SWITCH.SW1
P0.01_SW2_ONOFF: Q6.3(D2) R47.1 TP31.1 ; port MCU_SWITCH.SW2
P0.06_VEXT_EN: Q17.2(G1) R106.1 TP40.1 ; port ~{VEXT_EN}
P0.07_VLDO_EN: Q17.5(G2) R107.1 TP41.1 ; port ~{VLDO_EN}
P0.20_CAL100K: Q4.2(G1) R59.2 ; port LOAD_100K
P0.21_CAL10K: Q4.5(G2) R35.2 ; port LOAD_10K
P0.22_CAL1K: Q11.2(G1) R109.2 ; port LOAD_1K
P0.23_CAL100: Q11.5(G2) R108.2 ; port LOAD_100
P0.26_SW3_ONOFF: Q8.6(D1) R51.1 TP32.1 ; port MCU_SWITCH.SW3
P0.27_SW4_ONOFF: Q8.3(D2) R55.1 TP33.1 ; port MCU_SWITCH.SW4
P1.04_VOUT_EN: Q1.2(G1) R39.1 ; port ~{OUT_ENABLE}
NetC21_1: C21.1 Q5.3(D) R42.1
NetC22_1: C22.1 Q7.3(D) R46.1
NetC23_1: C23.1 Q9.3(D) R50.1
NetC24_1: C24.1 Q10.3(D) R54.2
NetQ1_6: Q1.6(D1) Q2.2(G1) Q2.5(G2) R37.2
NetQ4_3: Q4.3(D2) R58.2
NetQ4_6: Q4.6(D1) R40.1
NetQ5_1: Q5.1(G) R44.2
NetQ6_2: Q6.2(G1) R45.1
NetQ6_5: Q6.5(G2) R49.1
NetQ7_1: Q7.1(G) R48.2
NetQ8_2: Q8.2(G1) R53.1
NetQ8_5: Q8.5(G2) R57.1
NetQ9_1: Q9.1(G) R52.2
NetQ10_1: Q10.1(G) R56.2
NetQ11_3: Q11.3(D2) R38.1
NetQ11_6: Q11.6(D1) R33.2
NetQ14_2: Q14.2(G1) Q14.5(G2) Q17.6(D1) R104.1
NetQ16_2: Q16.2(G1) Q16.5(G2) Q17.3(D2) R105.1

### Notes on the sheet
- Size
- Date:
- A3
- Project Number
- Sheet         of
- Revision
- File:
- Drawn By:

### Library data of the parts
C5 = 0603-10u-10V-X7T-GRM188: CAP CER 10UF 10V X7T 0603; Manufacturer: Murata; Manufacturer Part Number: GRM188D71A106MA73; Part number IPS: 00000004696; Note: 10VDC; Artikkelnr Noca: N.A; Pad Count: 2; Part Number: 0603-10u-10V-X7T-GRM188; ComponentLink1Description: Datasheet; ComponentLink2Description: Supplier link; HelpURL: https://no.mouser.com/datasheet/2/281/murata_03052018_GRM_Series_1-1310166.pdf; Footprint Doc: 0603; LatestRevisionDate: 2020-10-13; Pin Count: 2; Publisher: Nordic Semiconductor; Published: 2018-09-11; Value: 10µF; Supplier 1: Digi-Key; Supplier Part Number 1: 490-7200-1-ND; Supplier 2: Mouser; Supplier Part Number 2: 81-GRM188D71A106MA3D; Component Class: Capacitors; PartId: 100200414
C17 C19 C20 = C0201-10n: Capacitor, X7R, ±10%; Part number IPS: 00000003480; Note: 10V; Artikkelnr Noca: N.A.; Pad Count: 2; Part Number: C0201-10n; LatestRevisionDate: 2017-11-09; Pin Count: 2; Publisher: Nordic Semiconductor; Published: 2014-11-13; Value: 10nF; Footprint Doc: 0201; ComponentLink1Description: Datasheet; ComponentLink2Description: Supplier link; Component Class: Capacitors; PartId: 100200067
C18 = C0402-4µ7: Capacitor, X5R, ±20%; Part number IPS: 00000001251, 00000007165; Note: 10V; Artikkelnr Noca: 20039482; Pad Count: 2; Part Number: C0402-4µ7; LatestRevisionDate: 2017-11-09; Pin Count: 2; Publisher: Nordic Semiconductor; Published: 2009-05-08; Value: 4.7µF; Footprint Doc: 0402; ComponentLink1Description: Datasheet; ComponentLink2Description: Supplier link; Supplier 1: Digi-Key; Supplier Part Number 1: 490-13252-1-ND; Component Class: Capacitors; PartId: 100200193
C21-C24 C67 = C0201-100n: as C2 on sheet pca63100_current_automatic_switch; Part Number: C0201-100n; LatestRevisionDate: 2017-11-09; Pin Count: 2; Publisher: Nordic Semiconductor; Published: 2014-11-13; Value: 100nF; Footprint Doc: 0201; ComponentLink1Description: Datasheet; ComponentLink2Description: Supplier link; Component Class: Capacitors; PartId: 100200078
P1 = Pin List Ang 1x4 SMD, 2.54mm: Pin List 1x4, 2.54mm (100mil), Right Angled, SMD; Part number IPS: 00000004780; Artikkelnr Noca: N.A.; Pad Count: 4; Part Number: Pin List Ang 1x4 SMD, 2.54mm; Footprint Doc: LIST_ANG_1x4-SMD-2.54MM; LatestRevisionDate: 2020-04-29; Pin Count: 4; Publisher: Nordic Semiconductor; Published: 2015-01-23; Value: Pin List 1x4, Angled; ComponentLink1Description: Datasheet; ComponentLink2Description: Supplier link; Supplier 1: Cabcon; Supplier Part Number 1: 1125B-1104S0Z135CR02; Supplier 2: Samtec; Supplier Part Number 2: TSM-104-01-L-SH-A; Component Class: Connectors; PartId: 100500358
Q1 Q4 Q6 Q8 Q11 Q17 = DMN2050LFDB: Dual N Ch MOFET, 3.3A, 45mOhm @ 5A, 4.5V, 730mW; Manufacturer: Diodes Incorporated; Manufacturer Part Number: DMN2050LFDB-7; Part number IPS: 00000004782; Artikkelnr Noca: N.A.; Pad Count: 6; Part Number: DMN2050LFDB; Footprint Doc: DFN-6; LatestRevisionDate: 2020-04-30; Pin Count: 6; Publisher: Nordic Semiconductor; Published: 2020-04-30; Value: DMN2050LFDB; Supplier 1: Digi-Key; Supplier Part Number 1: DMN2050LFDB-7DICT-ND; Supplier 2: Mouser; Supplier Part Number 2: 621-DMN2050LFDB-7; ComponentLink1URL: https://www.diodes.com/assets/Datasheets/DMN2050LFDB.pdf; ComponentLink1Description: Datasheet; ComponentLink2Description: Supplier link; HelpURL: https://www.diodes.com/assets/Datasheets/DMN2050LFDB.pdf; Component Class: Semiconductors; PartId: 101300176
Q2 Q14 Q16 = EFC6604R: Dual MOSFET, Dual N Channel, 13 A, 12 V, 0.009 ohm, 4.5 V, 2.5 V; Manufacturer: ON Semiconductor; Manufacturer Part Number: EFC6604R-TR; Part number IPS: 00000004783; Artikkelnr Noca: N.A.; Pad Count: 6; Part Number: EFC6604R; ComponentLink1URL: https://www.onsemi.com/pub/Collateral/EFC6604R-D.PDF; ComponentLink1Description: Datasheet; ComponentLink2URL: https://www.digikey.no/products/en/discrete-semiconductor-products/transistors-fets-mosfets-arrays/289?k=EFC6604; ComponentLink2Description: Supplier link; HelpURL: https://www.onsemi.com/products/discretes-drivers/mosfets/efc6604r; Footprint Doc: WLCSP-6; LatestRevisionDate: 2019-10-01; Pin Count: 6; Publisher: Nordic Semiconductor; Published: 2019-10-01; Value: EFC6604R; Supplier 1: Mouser; Supplier Part Number 1: 863-EFC6604R-TR; Supplier 2: Digi-Key; Supplier Part Number 2: EFC6604R-TR-ND; Component Class: Semiconductors; PartId: 101300168
Q5 Q7 Q9 Q10 = DMP1009UFDF: P Ch MOFET, 11A, 30mOhm max, 2W; Manufacturer: Diodes Incorporated; Part number IPS: 00000004784; Artikkelnr Noca: N.A.; Pad Count: 6; Part Number: DMP1009UFDF; Manufacturer Part Number: DMP1009UFDF; ComponentLink1URL: https://www.diodes.com/assets/Datasheets/DMP1009UFDF.pdf; ComponentLink1Description: Datasheet; ComponentLink2Description: Supplier link; Footprint Doc: UDFN-6; LatestRevisionDate: 2019-02-12; Pin Count: 6; Publisher: Nordic Semiconductor; Published: 2019-02-12; Value: DMP1009UFDF; Supplier 1: Digi-Key; Supplier Part Number 1: DMP1009UFDF-7DICT-ND; Component Class: Semiconductors; PartId: 101300164
R33 R41 = R0402-1k0_0.1%: Resistor, ±0.1%, 0.063W; Part number IPS: 00000004790; Note: Chip Res 0.1%; Artikkelnr Noca: 27469397; Pad Count: 2; Part Number: R0402-1k0_0.1%; Footprint Doc: 0402; LatestRevisionDate: 2016-06-02; Pin Count: 2; Publisher: Nordic Semiconductor; Published: 2015-11-11; ComponentLink1Description: Datasheet; ComponentLink2Description: Supplier link; Component Class: Resistors; PartId: 100100172
  R33: Value: 1k
  R41: Value: 10k
R35 R39 R59 R106-R109 = R0201-1M0: Resistor, ±1%, 0.05W; Part number IPS: 00000001418; Note: Chip Res 1%; Artikkelnr Noca: N.A.; Pad Count: 2; Part Number: R0201-1M0; Footprint Doc: 0201; LatestRevisionDate: 2014-11-13; Pin Count: 2; Publisher: Nordic Semiconductor; Published: 2014-11-13; Value: 1M0; ComponentLink1Description: Datasheet; ComponentLink2Description: Supplier link; Component Class: Resistors; PartId: 100100093
R37 R104 R105 = R0201-100k: Resistor, ±1%, 0.05W; Part number IPS: 00000001419; Note: Chip Res 1%; Artikkelnr Noca: N.A.; Pad Count: 2; Part Number: R0201-100k; Footprint Doc: 0201; LatestRevisionDate: 2014-11-13; Pin Count: 2; Publisher: Nordic Semiconductor; Published: 2014-11-13; Value: 100k; ComponentLink1Description: Datasheet; ComponentLink2Description: Supplier link; Component Class: Resistors; PartId: 100100080
R38 = R0805-100: Resistor, ±1%, 0.125W; Part number IPS: 00000004791; Note: Chip Res 1%; Artikkelnr Noca: 27089049; Pad Count: 2; Part Number: R0805-100; ComponentLink1Description: Datasheet; ComponentLink2Description: Supplier link; Footprint Doc: 0805; LatestRevisionDate: 2013-06-04; Pin Count: 2; Publisher: Nordic Semiconductor; Published: 2009-05-08; Value: 100R; Component Class: Resistors; PartId: 100100394
R40 = R0402-100k_0.1%: Resistor, ±0.1%, 0.063W; Part number IPS: 00000004792; Note: Chip Res 1%; Artikkelnr Noca: N.A.; Pad Count: 2; Part Number: R0402-100k_0.1%; ComponentLink1Description: Datasheet; ComponentLink2Description: Supplier link; Footprint Doc: 0402; LatestRevisionDate: 2016-02-12; Pin Count: 2; Publisher: Nordic Semiconductor; Published: 2016-02-12; Value: 100k; Supplier 1: Digi-key; Supplier Part Number 1: P100KDCCT-ND; Component Class: Resistors; PartId: 100100240
R42 = R0402-110: Resistor, ±1%, 0.063W; Part number IPS: 00000004793; Note: Chip Res 1%; Artikkelnr Noca: N.A.; Pad Count: 2; Part Number: R0402-110; ComponentLink1Description: Datasheet; ComponentLink2Description: Supplier link; Footprint Doc: 0402; LatestRevisionDate: 2017-08-15; Pin Count: 2; Publisher: Nordic Semiconductor; Published: 2017-08-15; Value: 470R; Supplier 1: Digi-Key; Supplier Part Number 1: 541-110LCT-ND; Component Class: Resistors; PartId: 100100150
R43 R47 R51 R55 = R0201-4k7: as R19 on sheet pca63100_current_automatic_switch; Part Number: R0201-4k7; Footprint Doc: 0201; LatestRevisionDate: 2014-11-13; Pin Count: 2; Publisher: Nordic Semiconductor; Published: 2014-11-13; Value: 4k7; ComponentLink1Description: Datasheet; ComponentLink2Description: Supplier link; Component Class: Resistors; PartId: 100100061
R44 R45 R48 R49 R52 R53 R56 R57 = R0201-47R: Resistor, ±1%, 0.05W; Part number IPS: 00000004794; Note: Chip Res 1%; Artikkelnr Noca: N.A.; Pad Count: 2; Part Number: R0201-47R; ComponentLink1Description: Datasheet; ComponentLink2Description: Supplier link; Footprint Doc: 0201; LatestRevisionDate: 2014-11-13; Pin Count: 2; Publisher: Nordic Semiconductor; Published: 2014-11-13; Value: 47R; Component Class: Resistors; PartId: 100100022
R46 = R0402-11R: Resistor, ±1%, 0.063W; Part number IPS: 00000007807; Note: Chip Res 1%; Artikkelnr Noca: N.A.; Pad Count: 2; Part Number: R0402-11R; ComponentLink1Description: Datasheet; ComponentLink2Description: Supplier link; Footprint Doc: 0402; LatestRevisionDate: 2016-11-09; Pin Count: 2; Publisher: Nordic Semiconductor; Published: 2016-11-09; Value: 22R; Supplier 1: Farnell; Supplier Part Number 1: 214-0577; Component Class: Resistors; PartId: 100100127
R50 = R0402-1R0: Resistor, ±1%, 0.063W; Part number IPS: 00000004795; Note: Chip Res 1%; Artikkelnr Noca: 27049001; Pad Count: 2; Part Number: R0402-1R0; ComponentLink1Description: Datasheet; ComponentLink2Description: Supplier link; Footprint Doc: 0402; LatestRevisionDate: 2012-06-22; Pin Count: 2; Publisher: Nordic Semiconductor; Published: 2012-06-22; Value: 1R; Component Class: Resistors; PartId: 100100112
R54 = R0402-0R051: RES SMD 0.051 OHM 1% 1/4W 0402; Manufacturer: Panasonic; Manufacturer Part Number: ERJ-2BWFR051X; Part number IPS: 00000004796; Note: Chip Res 1%; Artikkelnr Noca: N.A.; Pad Count: 2; Part Number: R0402-0R051; ComponentLink1Description: Datasheet; ComponentLink2Description: Supplier link; Footprint Doc: 0402; LatestRevisionDate: 2009-04-15; Pin Count: 2; Publisher: Nordic Semiconductor; Published: 2009-04-15; Value: 0R05; Supplier 1: Digi-Key; Supplier Part Number 1: P.051ATCT-ND; Supplier 2: Mouser; Supplier Part Number 2: 667-ERJ-2BWFR051X; Component Class: Resistors; PartId: 100100110
R58 = R0201-10k_0.1%: as R3 on sheet pca63100_current_automatic_switch; Part Number: R0201-10k_0.1%; Footprint Doc: 0201; LatestRevisionDate: 2019-10-07; Pin Count: 2; Publisher: Nordic Semiconductor; Published: 2019-10-07; Value: 10k; ComponentLink1Description: Datasheet; ComponentLink2Description: Supplier link; Component Class: Resistors; PartId: 100100597
TP6 TP7 = TP_SMD_Ø1.5MM: 1.5mm circular SMD testpad; Manufacturer: Nordic Semiconductor; Artikkelnr Noca: N.A.; Pad Count: 1; Part Number: TP_SMD_Ø1.5MM; ComponentLink1Description: Datasheet; ComponentLink2Description: Supplier link; Footprint Doc: TP_SMD_Ø1.5mm; LatestRevisionDate: 2016-06-02; Pin Count: 1; Publisher: Nordic Semiconductor; Published: 2016-06-02; Value: Ø1.5mm,SMD; Part number IPS: N.A.; Component Class: Connectors; PartId: 100500477
TP30-TP33 TP40 TP41 = TP_SMD_Ø0.7MM: as TP1 on sheet pca63100_current_automatic_switch; Part Number: TP_SMD_Ø0.7MM; ComponentLink1Description: Datasheet; ComponentLink2Description: Supplier link; Footprint Doc: TP_SMD_Ø0.7mm; LatestRevisionDate: 2017-12-14; Pin Count: 1; Publisher: Nordic Semiconductor; Published: 2017-12-14; Value: Ø0.7mm,SMD; Part number IPS: N.A.; Component Class: Connectors; PartId: 100500474